# EAGLE board EEZ CF-DIC r5B6 (EAGLE 7.2.0), part 1 of 2
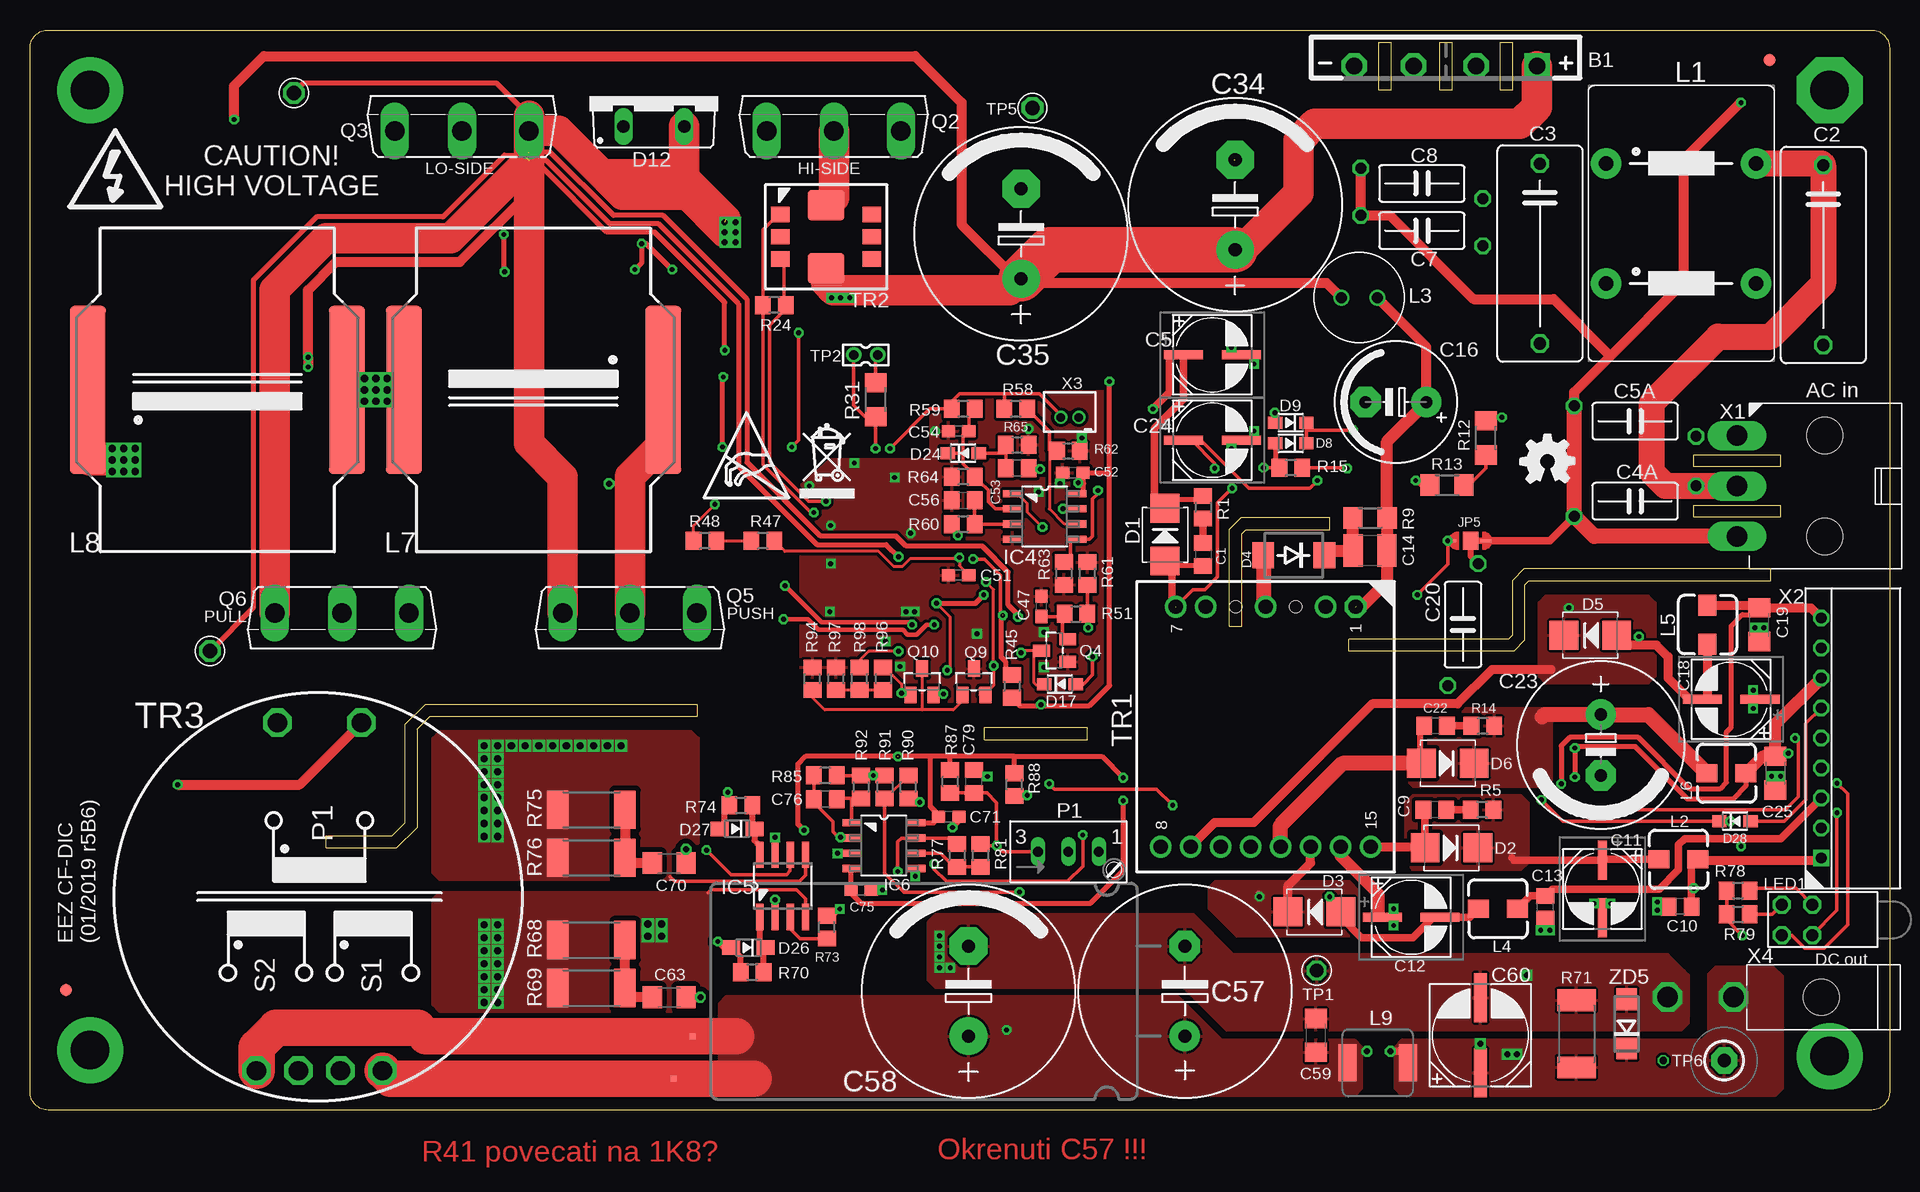
[diagram p3: board, top side]
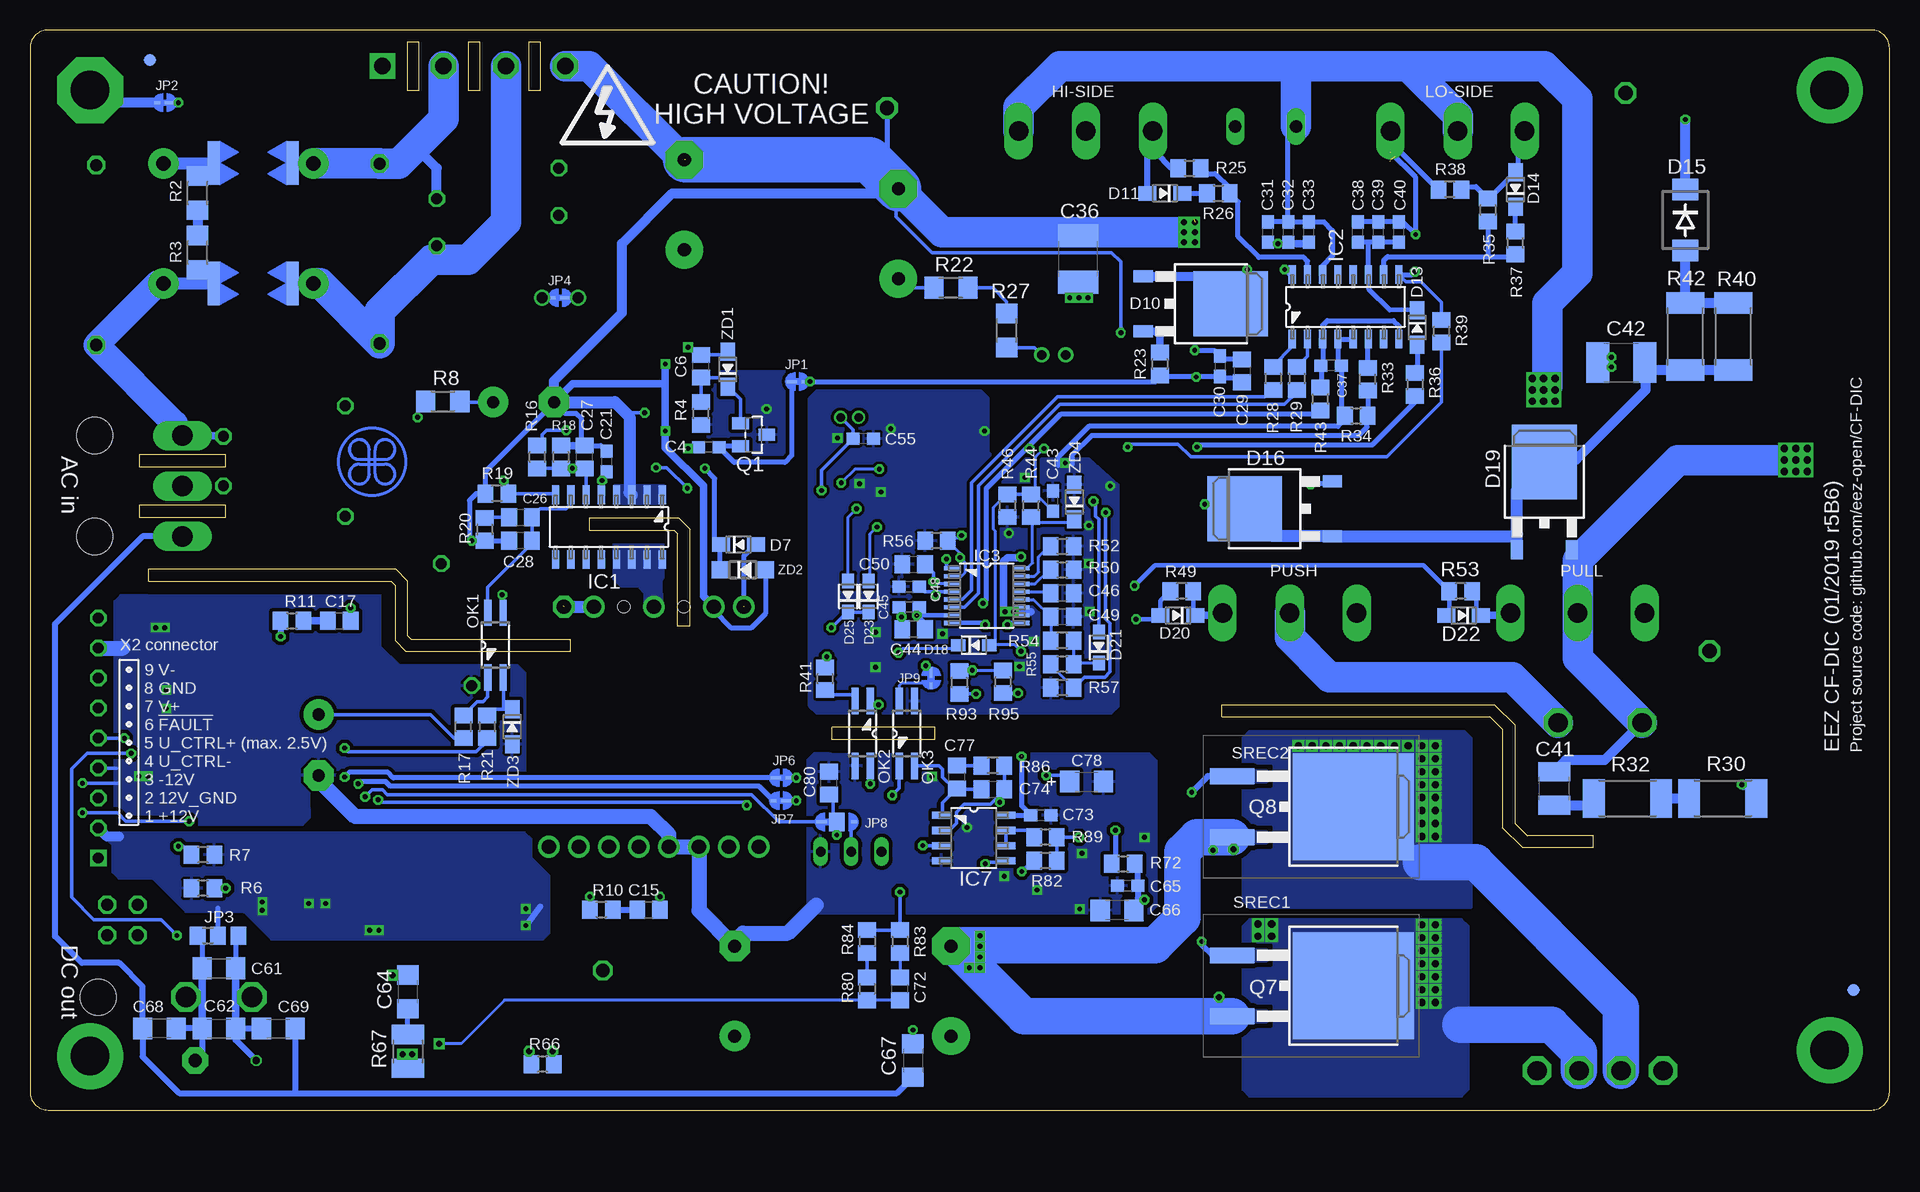
[diagram p4: board, bottom side, seen from below]

Size 155 x 90 mm. Coordinates in mm from the lower left corner, seen from the top.
Outline: 108.35,49.34 100.95,49.34 100,48.39 100,40.29 101.02,40.29 101.02,48.01 101.33,48.32 108.35,48.32 108.35,49.34
Outline: 145.1,45.09 124.52,45.09 123.56,44.12 123.56,39.57 123.24,39.24 109.92,39.24 109.92,38.23 123.69,38.23 124.57,39.13 124.57,43.74 124.9,44.07 145.1,44.07 145.1,45.09
Outline: 79.57,31.88 88.14,31.88 88.14,30.86 79.57,30.86 79.57,31.88
Outline: 155,88.5 155,1.5 arc-90 153.5,0 1.5,0 arc-90 0,1.5 0,88.5 arc-90 1.5,90 153.5,90 arc-90 155,88.5
Outline: 55.63,32.77 55.63,33.78 32.92,33.78 31.24,32.11 31.24,23.9 30.2,22.86 24.7,22.86 24.7,21.84 30.58,21.84 32.26,23.52 32.26,31.73 33.3,32.77 55.63,32.77
Copper layers (1*16): Top 0.035mm / dielectric 1.5mm / Bottom 0.035mm
Design rules "default *": minimum track width 6mil, minimum drill 0.3mm, track to track 6mil, track to pad 6mil, pad to pad 6mil, via to via 6mil, smd to smd 6mil, copper to edge 40mil, drill to drill 8mil, minimum pad ring 4mil, minimum via ring 8mil, stop-mask expansion 2.5mil, vias tented up to drill 2.1mm, thermal gap 8mil
Net classes: 0 default: width 0.203 mm, drill 0.4 mm, clearance 0.203 mm; 2 gnd: width 0.254 mm, drill 0.4 mm, clearance 0.152 mm to class 0, clearance 0.152 mm to class 1, clearance 0.152 mm

## Footprints (pad centres in the part's own frame; a part is rotated, then mirrored left to right if it is on the bottom)
GBU4K_CRE = drill 1.4 square: + -7.62,0 | drill 1.4 octagon: - 7.62,0; AC1 -2.54,0; AC2 2.667,0
C0805 = smd 1.3 x 1.5: 1 -0.95,0; 2 0.95,0
C150-072X183 = drill 1.016 octagon: 1 -7.493,0; 2 7.493,0
C0603 = smd 1.1 x 1: 1 -0.85,0; 2 0.85,0
CY075-032X103-ROTATED = drill 0.914 octagon: 1 -5.08,-1.27; 2 5.08,1.27
CAPAE660X610N = smd 3.251 x 0.762: 1 -2.413,0; 2 2.413,0
CY075-032X103 = drill 0.914 octagon: 1 -5.08,1.27; 2 5.08,-1.27
C1210 = smd 1.6 x 2.7: 1 -1.4,0; 2 1.4,0
ECAP5/10.5 = drill 1.016 pad 2.54: + -2.54,0 | drill 1.016 pad 2.54 octagon: - 2.54,0
C1206 = smd 1.6 x 1.8: 1 -1.4,0; 2 1.4,0
ECAP5/13 = drill 1.016 pad 2.54: + -2.54,0 | drill 1.016 pad 2.54 octagon: - 2.54,0
ECAP7.5/18 = drill 1.1 pad 3.14: + -3.75,0 | drill 1.1 pad 3.14 octagon: - 3.75,0
C1812 = smd 1.9 x 3.4: 1 -1.95,0; 2 1.95,0
ECAP7.5/18-H35.5-2A = drill 1.1 pad 2.54: + 3.75,0 | drill 1.1 pad 2.54 octagon: - -3.75,0
CAPAE830X1050N = smd 4.064 x 1.092: + -3.124,0; - 3.124,0
EC1206 = smd 1.6 x 1.8: + -1.4,0; - 1.4,0
SMB = smd 2.4 x 2.4: A 2.2,0; C -2.2,0
DO214AA = smd 1.8 x 2.2: A 2.55,0; C -2.55,0
SOD323-W = smd 1.5 x 1.2: A 1.45,0; C -1.45,0
SOD323-R = smd 1.2 x 1: A 1.3,0; C -1.3,0
TO252-L = smd 1 x 1.6: 1 -2.28,-6.07; 2 2.28,-6.07 | smd 5.4 x 6.2: 3 0,1.23
TO220-2 = drill 1.016 long: 1 -2.54,-2.54; 2 2.54,-2.54
FIDUCIAL_DUAL = smd 1.016 x 1.016 bottom: B 0,0 | smd 1.016 x 1.016: T 0,0
SOIC-16 = smd 1.549 x 0.61: 1 -2.692,4.445; 2 -2.692,3.175; 3 -2.692,1.905; 4 -2.692,0.635; 5 -2.692,-0.635; 6 -2.692,-1.905; 7 -2.692,-3.175; 8 -2.692,-4.445; 9 2.692,-4.445; 10 2.692,-3.175; 11 2.692,-1.905; 12 2.692,-0.635; 13 2.692,0.635; 14 2.692,1.905; 15 2.692,3.175; 16 2.692,4.445
MTC16 = smd 1.422 x 0.356: 1 -2.845,2.275; 2 -2.845,1.625; 3 -2.845,0.975; 4 -2.845,0.325; 5 -2.845,-0.325; 6 -2.845,-0.975; 7 -2.845,-1.625; 8 -2.845,-2.275; 9 2.845,-2.275; 10 2.845,-1.625; 11 2.845,-0.975; 12 2.845,-0.325; 13 2.845,0.325; 14 2.845,0.975; 15 2.845,1.625; 16 2.845,2.275
SOIC127P600X173-8N = smd 1.55 x 0.6: 1 -2.7,1.9; 2 -2.7,0.63; 3 -2.7,-0.64; 4 -2.7,-1.91; 5 2.7,-1.91; 6 2.7,-0.64; 7 2.7,0.63; 8 2.7,1.9
SO8 = smd 0.6 x 2.2: 1 -1.905,-2.6; 2 -0.635,-2.6; 3 0.635,-2.6; 4 1.905,-2.6; 5 1.905,2.6; 6 0.635,2.6; 7 -0.635,2.6; 8 -1.905,2.6
JP2-NOCUT = smd 0.889 x 0.254: 1 -0.445,0 | smd 0.508 x 0.254: 2 0.635,0
A0R-JMP = smd 1.5 x 1.3: 1 0,1.7; 2 0,0; 3 0,-1.7
JP3-CUT = smd 1.27 x 1.524: COM 0,0 | smd 0.889 x 0.254: NC -1.27,0 | smd 0.508 x 0.254: NO 1.46,0
RN214 = drill 1.2 pad 2.54: 1 -6.25,-5; 2 6.25,-5; 3 -6.25,5; 4 6.25,5
DE0403 = smd 1.5 x 1.75: 1 0,1.626; 2 0,-1.625
FERSYTER_DSZ6 = drill 0.9: P$1 -1.5,0; P$2 1.5,0
MURATA_6000B = smd 3 x 14: 1 -10.8,0; 2 10.8,0
IHLP-2020BZ-11 = smd 3.048 x 1.524: 1 0,2.515; 2 0,-2.515
L-934EB = drill 1 octagon: BA -1.27,-1.27; BC -1.27,1.27; TA 1.27,-1.27; TC 1.27,1.27
SO4 = smd 0.6 x 2.2: 1 -0.635,-2.7; 2 0.635,-2.7; 3 0.635,2.7; 4 -0.635,2.7
S64W = drill 0.813 long: A 2.54,1.27; E -2.54,1.27; S 0,1.27
SOT23-BEC = smd 1 x 1.4: B -0.95,-1.1; C 0,1.1; E 0.95,-1.1
TO247BV = drill 1.6 long: D 0,-2.921; G -5.588,-2.921; S 5.588,-2.921
SOT23 = smd 1 x 1.4: 1 -0.95,-1.1; 2 0.95,-1.1; 3 0,1.1
TO263 = smd 1.3 x 3.7: 1 -2.54,-7.87; 2 2.54,-7.87 | smd 8.9 x 10.1: 3 0,2.23
R0805 = smd 1.3 x 1.5: 1 -0.95,0; 2 0.95,0
R1206 = smd 1.6 x 1.803: 1 -1.422,0; 2 1.422,0
R2512 = smd 1.8 x 3.2: 1 -2.8,0; 2 2.8,0
R1210 = smd 1.6 x 2.7: 1 -1.4,0; 2 1.4,0
PCB-SAR_2.4MM = smd 3.632 x 1.016: 1 0,-3.302; 2 0,3.302
SHORT_NOHOLE = smd 0.5 x 0.25 bottom: P$1 0,0.117; P$2 0,-0.117
PCB_SHIELD_TAB = drill 1.1 octagon: 1 0,0
2MM-2 = drill 0.8 pad 1.27: 1 0,-1; 2 0,1
TEST-PIN_1.2MM = drill 1.2 octagon: 1 0,0
TP_1.1MM_2 = drill 0.6 octagon: GND 5.08,0 | drill 1.1 pad 2.184 octagon: TIP 0,0
FERYSTER_5572 = drill 1.2 octagon: 1 -10,7.5 | drill 1.2: 2 -10,5; 4 -10,0; 6 -10,-5; 7 -10,-7.5; 8 10,-8.75; 9 10,-6.25; 10 10,-3.75; 11 10,-1.25; 12 10,1.25; 13 10,3.75; 14 10,6.25; 15 10,8.75 | hole 1: -10,2.5; -10,-2.5
MURATA_5300 = smd 1.27 x 1.524: 1 -1.854,-3.81; 2 0,-3.81; 3 1.854,-3.81; 4 1.854,3.81; 5 0,3.81; 6 -1.854,3.81 | smd 2.54 x 3.048: 7 2.616,0; 8 -2.616,0
VAC_DUAL_SEC = drill 1.6 octagon: P1 -14.5,3.5; P1_DOT -14.5,-3.5; S1 14.5,5.25; S1_DOT 14.5,1.75; S2 14.5,-1.75; S2_DOT 14.5,-5.25
MINIFIT_6659-3_CRE = drill 1.7 long: 1 0,-4.2; 2 0,0; 3 0,4.2 | hole 3: -7.3,4.2; -7.3,-4.2
SPOX_22-05-7095 = drill 0.9 square: 1 -10,0 | drill 0.9 octagon: 2 -7.5,0; 3 -5,0; 4 -2.5,0; 5 0,0; 6 2.5,0; 7 5,0; 8 7.5,0; 9 10,0
B2B-ZR = drill 0.7 pad 1.1: 1 -0.75,0; 2 0.75,0
MINIFIT_39301020 = drill 1.7 octagon: 1 0,0; 2 0,5.5 | hole 3: 0,-7.3
SOD123 = smd 1.4 x 1.4: A 1.9,0; C -1.9,0
DO214AC = smd 1.8 x 1.7: A 2.05,0; C -2.05,0

## Placement (x,y rotation side)
B1  GBU4K  [GBU4K_CRE]  118,87 180 top
C1  3n3  [C0805]  97.79,46.29 270 top
C2  MKP-X2-220NR15/310  [C150-072X183]  149.48,71.25 270 top
C3  MKP-X2-220NR15/310  [C150-072X183]  125.86,71.37 270 top
C4  N.C.  [C0603]  98.42,55.24 180 bottom
C4A  N.C.  [CY075-032X103-ROTATED]  133.79,50.74 0 top
C5  EEEFK1V470P  [CAPAE660X610N]  98.55,62.93 0 top
C5A  N.C.  [CY075-032X103]  133.79,57.4 0 top
C6  1u  [C0805]  99.06,61.98 90 bottom
C7  CY1Y-4N7  [CY075-032X103]  116.01,73.28 0 top
C8  CY1Y-4N7  [CY075-032X103]  116.01,77.22 0 top
C9  3n3  [C0805]  117.09,25.02 180 top
C10  1u  [C0805]  137.54,16.95 180 top
C11  EEEFK1V470P  [CAPAE660X610N]  131.06,18.41 270 top
C12  EEEFK1V470P  [CAPAE660X610N]  115.13,16.07 0 top
C13  1u  [C0805]  126.3,16.89 90 top
C14  1n/1kV  [C1210]  111.7,46.61 180 top
C15  3n3  [C0805]  103.44,16.7 0 bottom
C16  UCY2G6R8MPD  [ECAP5/10.5]  113.86,58.99 180 top
C17  3n3  [C0805]  129.22,40.77 0 bottom
C18  EEEFK1V470P  [CAPAE660X610N]  141.8,34.23 180 top
C19  4u7  [C1206]  144.15,40.45 90 top
C20  CY1Y-4N7  [CY075-032X103]  119.44,40.45 270 top
C21  100n  [C0603]  106.93,54.04 270 bottom
C22  3n3  [C0805]  117.16,32 180 top
C23  1500u  [ECAP5/13]  130.94,30.42 270 top
C24  EEEFK1V470P  [CAPAE660X610N]  98.55,55.82 0 top
C25  4u7  [C1206]  145.48,28.07 270 top
C26  33n  [C0805]  114.11,49.4 0 bottom
C27  100p  [C0805]  108.78,54.42 90 bottom
C28  2n2  [C0805]  114.11,47.43 180 bottom
C29  1u  [C0805]  53.98,61.59 270 bottom
C30  100n  [C0603]  55.82,61.98 270 bottom
C31  10n  [C0603]  51.82,73.15 90 bottom
C32  100n  [C0603]  50.1,73.15 90 bottom
C33  100n  [C0603]  48.39,73.15 90 bottom
C34  UPH2G151MHD6  [ECAP7.5/18]  100.46,75.44 90 top
C35  UPH2G151MHD6  [ECAP7.5/18]  82.61,73.03 90 top
C36  100n/500V  [C1812]  67.63,70.93 90 bottom
C37  100n  [C0603]  46.55,62.04 180 bottom
C38  10n  [C0603]  44.32,73.15 90 bottom
C39  100n  [C0603]  42.61,73.15 90 bottom
C40  100n  [C0603]  40.89,73.15 90 bottom
C41  4n7/200V  [C1210]  27.94,26.8 90 bottom
C42  100n/500V  [C1812]  22.35,62.29 0 bottom
C43  10n  [C0603]  69.72,50.74 90 bottom
C44  1u  [C0805]  81.34,40.07 180 bottom
C45  100n  [C0603]  81.72,41.91 180 bottom
C46  1u  [C0805]  68.96,43.05 180 bottom
C47  10n  [C0603]  84.33,41.97 90 top
C48  100n  [C0603]  81.72,43.62 0 bottom
C49  2n2  [C0805]  68.96,41.08 180 bottom
C50  100p  [C0805]  81.34,45.47 0 bottom
C51  10n  [C0603]  77.41,44.58 180 top
C52  100n  [C0603]  86.93,53.09 180 top
C53  1u  [C0805]  82.3,53.47 180 top
C54  100n  [C0603]  77.41,56.58 180 top
C55  N.C.  [C0603]  85.53,55.94 180 bottom
C56  1u  [C0805]  77.79,50.8 0 top
C57  UPW1J152MHD  [ECAP7.5/18-H35.5-2A]  96.27,9.91 270 top
C58  N.C.  [ECAP7.5/18]  78.23,9.91 90 top
C59  1u/100V  [C1206]  107.19,6.22 90 top
C60  HHXC630ARA330MHA0G  [CAPAE830X1050N]  120.9,6.22 90 top
C61  1u/100V  [C1206]  139.26,11.81 0 bottom
C62  100n/100V  [C1206]  139.26,6.79 0 bottom
C63  4n7/200V  [C1206]  53.28,9.4 0 top
C64  N.C.  [C1206]  123.51,9.84 270 bottom
C65  100n  [C0603]  63.5,18.67 180 bottom
C66  4u7  [C1206]  64.39,16.64 180 bottom
C67  4n7/200V  [C1206]  81.41,4.13 270 bottom
C68  4n7/200V  [C1206]  144.21,6.79 180 bottom
C69  4n7/200V  [C1206]  134.3,6.79 0 bottom
C70  4n7/200V  [C1206]  53.28,20.57 0 top
C71  100n  [C0603]  76.58,24.45 0 top
C72  1n  [C0805]  82.49,10.1 90 bottom
C73  100n  [C0603]  70.74,24.57 0 bottom
C74  47p  [C0805]  74.74,26.73 0 bottom
C75  100n  [C0603]  69.28,18.35 0 top
C76  100p  [C0805]  66.29,25.91 180 top
C77  470p  [C0805]  77.72,27.75 90 bottom
C78  N.C.  [EC1206]  66.93,27.37 0 bottom
C79  1u  [C0805]  78.68,27.37 90 top
C80  N.C.  [C0805]  88.39,27.24 90 bottom
D1  SS110B  [SMB]  94.61,47.94 270 top
D2  SS110B  [SMB]  118.49,21.84 180 top
D3  SS110B  [SMB]  107.06,16.51 0 top
D4  US1K-DIO  [DO214AA]  105.35,46.23 180 top
D5  SS110B  [SMB]  130.05,39.56 0 top
D6  SS110B  [SMB]  118.17,28.89 180 top
D7  1N5819HW-7-F  [SOD323-W]  95.95,47.12 0 bottom
D8  BAS316  [SOD323-R]  105.09,55.56 180 top
D9  BAS316  [SOD323-R]  105.09,57.28 180 top
D10  C3D02065E  [TO252-L]  56.13,67.18 270 bottom
D11  1N5819HW-7-F  [SOD323-W]  60.39,76.39 180 bottom
D12  C3D03060A  [TO220-2]  52,84.5 0 top
D13  1N5819HW-7-F  [SOD323-W]  39.37,65.21 270 bottom
D14  1N5819HW-7-F  [SOD323-W]  31.18,76.71 90 bottom
D15  US1K-DIO  [DO214AA]  17.02,74.17 270 bottom
D16  C3D02065E  [TO252-L]  52.51,50.1 90 bottom
D17  BAS316  [SOD323-R]  85.85,35.5 0 top
D18  BAS316  [SOD323-R]  76.33,38.73 0 bottom
D19  C3D02065E  [TO252-L]  28.77,52.77 0 bottom
D20  N.C.  [SOD323-W]  59.31,41.21 180 bottom
D21  BAS316  [SOD323-R]  65.91,38.54 90 bottom
D22  N.C.  [SOD323-W]  35.5,41.21 180 bottom
D23  BAS316  [SOD323-R]  85.09,42.8 90 bottom
D24  BAS316  [SOD323-R]  77.79,54.74 0 top
D25  BAS316  [SOD323-R]  86.8,42.8 90 bottom
D26  1N5819HW-7-F  [SOD323-W]  59.88,13.53 180 top
D27  1N5819HW-7-F  [SOD323-W]  58.93,23.43 180 top
D28  BAS316  [SOD323-R]  142.11,24.07 0 top
EEZ_SIGNATURE  SIGNATURESMALL  [SIGNATURE_5MM]  126.47,54.02 180 top
FM1  FIDUCIAL_2  [FIDUCIAL_DUAL]  145,87.5 270 top
FM2  FIDUCIAL_2  [FIDUCIAL_DUAL]  3,10 270 top
IC1  VIPer35L  [SOIC-16]  106.74,48.58 270 bottom
IC2  SI8233BB-D-IS1  [SOIC-16]  45.34,66.93 90 bottom
IC3  LM5041B  [MTC16]  75.25,42.86 0 bottom
IC4  LM258D  [SOIC127P600X173-8N]  84.58,49.47 0 top
IC5  IR11688STRPBF  [SO8]  62.74,18.67 0 top
IC6  LM258D  [SOIC127P600X173-8N]  71.18,22.03 0 top
IC7  TL103W  [SOIC127P600X173-8N]  76.33,22.67 0 bottom
JP1  JP2-NOCUT  [JP2-NOCUT]  91.06,60.71 0 bottom
JP2  JP2-NOCUT  [JP2-NOCUT]  143.76,83.95 180 bottom
JP3  0R-JUMPA  [A0R-JMP]  139.32,14.54 90 bottom
JP4  JP2-NOCUT  [JP2-NOCUT]  110.81,67.69 180 bottom
JP5  JP3-CUT  [JP3-CUT]  120.08,47.43 180 top
JP6  JP2-NOCUT  [JP2-NOCUT]  92.39,27.69 0 bottom
JP7  JP2-NOCUT  [JP2-NOCUT]  92.39,25.78 180 bottom
JP8  JP3-CUT  [JP3-CUT]  87.76,24 0 bottom
JP9  JP2-NOCUT  [JP2-NOCUT]  79.88,36 270 bottom
L1  RN214-2.5-02-3M3  [RN214]  137.64,73.88 0 top
L2  DLG-0403-180  [DE0403]  137.41,20.89 90 top
L3  RLB0812-471KL  [FERSYTER_DSZ6]  110.81,67.69 0 top
L4  DLG-0403-180  [DE0403]  122.36,16.76 90 top
L5  DLG-0403-180  [DE0403]  139.83,40.45 180 top
L6  DLG-0403-180  [DE0403]  141.41,28.07 90 top
L7  60B684C  [MURATA_6000B]  41.97,60.01 180 top
L8  60B684C  [MURATA_6000B]  15.62,60.01 0 top
L9  IHLP2020CZER3R3M11  [IHLP-2020BZ-11]  112.33,3.94 90 top
LED1  L-934EB/1Y1ID-RV  [L-934EB]  147.3,15.85 180 top
OK1  TLP291-GB.SE-T  [SO4]  116.2,38.73 0 bottom
OK2  TLP291-GB.SE-T  [SO4]  85.6,31.37 180 bottom
OK3  TLP291-GB.SE-T  [SO4]  81.92,31.37 0 bottom
P1  T910W-50K  [S64W]  86.55,20.26 0 top
Q1  MMBT5551  [SOT23-BEC]  94.68,56.26 270 bottom
Q2  C3M0280090D  [TO247BV]  67,84.5 0 top
Q3  C3M0280090D  [TO247BV]  36,84.5 0 top
Q4  NYC0102BLT1G  [SOT23]  85.41,38.29 90 top
Q5  IPW60R120P7  [TO247BV]  50,38.5 180 top
Q6  IPW60R120P7  [TO247BV]  26,38.5 180 top
Q7  FDD86250-F085  [TO263]  46.93,10.35 270 bottom
Q8  FDD86250-F085  [TO263]  46.93,25.27 270 bottom
Q9  BC856C  [SOT23-BEC]  78.68,35.69 0 top
Q10  BC856C  [SOT23-BEC]  74.36,35.69 0 top
R1  120R  [R0805]  97.79,50.23 270 top
R2  220K  [R1206]  141.04,76.4 270 bottom
R3  220K  [R1206]  141.04,71.45 270 bottom
R4  1K8  [R0805]  99.06,58.04 90 bottom
R5  120R  [R0805]  121.03,25.02 180 top
R6  N.C.  [R0805]  140.59,18.48 180 bottom
R7  N.C.  [R0805]  140.59,21.27 180 bottom
R8  100K  [R1206]  120.59,59.05 180 bottom
R9  220K  [R1206]  111.7,49.34 180 top
R10  120R  [R0805]  107.38,16.7 0 bottom
R11  120R  [R0805]  133.16,40.77 0 bottom
R12  100K  [R1206]  121.35,56.01 270 top
R13  100K  [R1206]  118.11,52.07 180 top
R14  120R  [R0805]  121.09,32 180 top
R15  N.C.  [R0805]  105.09,53.53 180 top
R16  47K  [R0805]  112.71,54.42 90 bottom
R17  1K  [R0805]  118.87,31.94 90 bottom
R18  12K  [R0805]  110.74,54.42 270 bottom
R19  1K8  [R0805]  116.08,51.37 180 bottom
R20  47K  [R0805]  117.09,48.39 270 bottom
R21  1K  [R0805]  116.9,31.94 270 bottom
R22  100K  [R1206]  78.23,68.52 0 bottom
R23  10R  [R0805]  60.83,62.17 270 bottom
R24  10K  [R0805]  62.04,67.08 180 top
R25  33R  [R0805]  58.36,78.49 0 bottom
R26  10R  [R0805]  55.94,76.39 0 bottom
R27  100K  [R1206]  73.6,64.96 270 bottom
R28  100R  [R0805]  51.37,60.96 270 bottom
R29  100R  [R0805]  49.4,60.96 270 bottom
R30  22R/2-3W  [R2512]  13.91,25.97 0 bottom
R31  100K  [R1206]  70.48,59.18 270 top
R32  22R/2-3W  [R2512]  21.84,25.97 0 bottom
R33  30K  [R0805]  43.5,60.9 90 bottom
R34  1R  [R0805]  44.45,57.85 0 bottom
R35  33R  [R0805]  33.46,74.99 90 bottom
R36  10R  [R0805]  39.56,60.45 270 bottom
R37  10R  [R0805]  31.18,72.26 90 bottom
R38  47K  [R0805]  36.64,76.71 180 bottom
R39  1R  [R0805]  37.34,64.9 90 bottom
R40  22R/2-3W  [R2512]  13.02,64.45 90 bottom
R41  1K  [R0805]  88.71,35.94 90 bottom
R42  22R/2-3W  [R2512]  17.02,64.45 90 bottom
R43  10R  [R0805]  47.43,59.25 90 bottom
R44  1K  [R0805]  71.56,50.36 90 bottom
R45  10R  [R0805]  81.85,35.31 270 top
R46  7K5  [R0805]  73.53,50.36 270 bottom
R47  86K6  [R0805]  61.09,47.43 180 top
R48  86K6  [R0805]  56.26,47.43 180 top
R49  10R  [R0805]  58.99,43.24 180 bottom
R50  15K  [R0805]  68.96,45.02 0 bottom
R51  4K7  [R0805]  87.19,41.34 0 top
R52  86K6  [R0805]  68.96,46.99 0 bottom
R53  10R  [R0805]  35.75,43.24 180 bottom
R54  1K  [R0805]  68.96,39.12 180 bottom
R55  6R2  [R0805]  68.96,37.15 180 bottom
R56  1K  [R0805]  79.44,47.43 180 bottom
R57  1K  [R0805]  68.96,35.18 180 bottom
R58  4K7  [R0805]  82.17,58.42 180 top
R59  5K6  [R0805]  77.79,58.42 180 top
R60  30K  [R0805]  77.79,48.83 0 top
R61  1K  [R0805]  88.14,44.7 90 top
R62  30K  [R0805]  86.55,54.93 0 top
R63  10K  [R0805]  86.17,44.7 270 top
R64  1K  [R0805]  77.79,52.77 180 top
R65  1K  [R0805]  82.3,55.44 0 top
R66  120R  [R0805]  112.27,3.81 180 bottom
R67  N.C.  [R1210]  123.51,4.89 270 bottom
R68  22R/2-3W  [R2512]  46.8,14.16 0 top
R69  22R/2-3W  [R2512]  46.8,10.16 0 top
R70  3R3  [R0805]  60.2,11.49 0 top
R71  N.C.  [R2512]  128.91,6.35 270 top
R72  10R  [R0805]  63.88,20.51 0 bottom
R73  47K  [R0805]  66.42,15.24 90 top
R74  3R3  [R0805]  59.25,25.4 0 top
R75  22R/2-3W  [R2512]  46.8,25.02 0 top
R76  22R/2-3W  [R2512]  46.8,21.02 0 top
R77  10K  [R0805]  77.28,21.21 270 top
R78  470R  [R0805]  142.37,18.29 0 top
R79  470R  [R0805]  142.37,16.32 0 top
R80  150K  [R0805]  85.22,10.1 270 bottom
R81  10K  [R0805]  79.25,21.21 90 top
R82  1K  [R0805]  70.36,20.76 180 bottom
R83  30K  [R0805]  82.49,14.03 270 bottom
R84  1K8  [R0805]  85.22,14.03 270 bottom
R85  1K  [R0805]  66.29,27.88 180 top
R86  86K6  [R0805]  74.74,28.7 180 bottom
R87  1K8  [R0805]  76.71,27.37 90 top
R88  3K3  [R0805]  82.04,27.11 90 top
R89  1K  [R0805]  70.36,22.73 180 bottom
R90  5K6  [R0805]  73.22,26.92 90 top
R91  7K5  [R0805]  71.25,26.92 270 top
R92  220R  [R0805]  69.28,26.92 270 top
R93  10K  [R0805]  77.53,35.62 270 bottom
R94  10K  [R0805]  65.21,35.94 90 top
R95  150K  [R0805]  73.91,35.69 270 bottom
R96  39K  [R0805]  71.12,35.94 270 top
R97  15K  [R0805]  67.18,35.94 90 top
R98  47K  [R0805]  69.15,35.94 90 top
SAR1  PCB 2.4mm  [PCB-SAR_2.4MM]  136.4,78.92 270 bottom
SAR2  PCB 2.4mm  [PCB-SAR_2.4MM]  136.4,68.88 270 bottom
SH1  [SHORT_NOHOLE]  100.46,79.18 270 top
SH2  [SHORT_NOHOLE]  72.52,46.04 90 top
SH3  [SHORT_NOHOLE]  53.66,2.6 270 bottom
SH4  [SHORT_NOHOLE]  55.24,6.16 90 bottom
TP1  [PCB_SHIELD_TAB]  107.25,11.62 0 top
TP2  [2MM-2]  69.66,62.93 90 top
TP3  [TEST-PIN_1.2MM]  22,84.75 270 top
TP4  [TEST-PIN_1.2MM]  15,38.25 270 top
TP5  [TEST-PIN_1.2MM]  83.57,83.5 0 top
TP6  [TP_1.1MM_2]  141.22,4.13 180 top
TR1  FERYSTER_5851  [FERYSTER_5572]  103,31.94 270 top
TR2  53100C  [MURATA_5300]  66.36,72.77 270 top
TR3  VAC T60006-L2025-W380  [VAC_DUAL_SEC]  24.13,17.78 270 top
U$2  [RECYCLE_BIN1/8]  64.14,50.99 0 top
U$4  [ESD_SYMBOL]  56.17,51.03 0 top
X1  39-30-3035  [MINIFIT_6659-3_CRE]  142.3,52 180 top
X2  22-05-7095  [SPOX_22-05-7095]  149.3,31 90 top
X3  B2B-ZR  [B2B-ZR]  86.68,57.72 180 top
X4  39-30-1020  [MINIFIT_39301020]  142,9.4 90 top
ZD1  BZX384-C15  [SOD323-W]  96.84,61.72 90 bottom
ZD2  BZT52C20-DC  [SOD123]  95.57,45.02 0 bottom
ZD3  MMSZ5V1T1G  [SOD323-W]  114.81,31.94 270 bottom
ZD4  MMSZ5V1T1G  [SOD323-W]  67.94,50.67 90 bottom
ZD5  SMAJ58A-TR  [DO214AC]  133.1,7.18 90 top